# Altium schematic sheet EVB-ANNA-B5_SCHEM_0000_Topsheet.SchDoc
size A3; Date: 7/24/2020; CompanyName: U-Blox; DrawnBy: EMOO; Engineer: EMOO; Organization: U-Blox; Address1: 3950 Fairview Industrial Dr SE #100; Address2: Salem, OR 97302; DocumentNumber: 1; SheetNumber: 1; SheetTotal: 8; SheetSize: B; SheetTitle: TopSheet
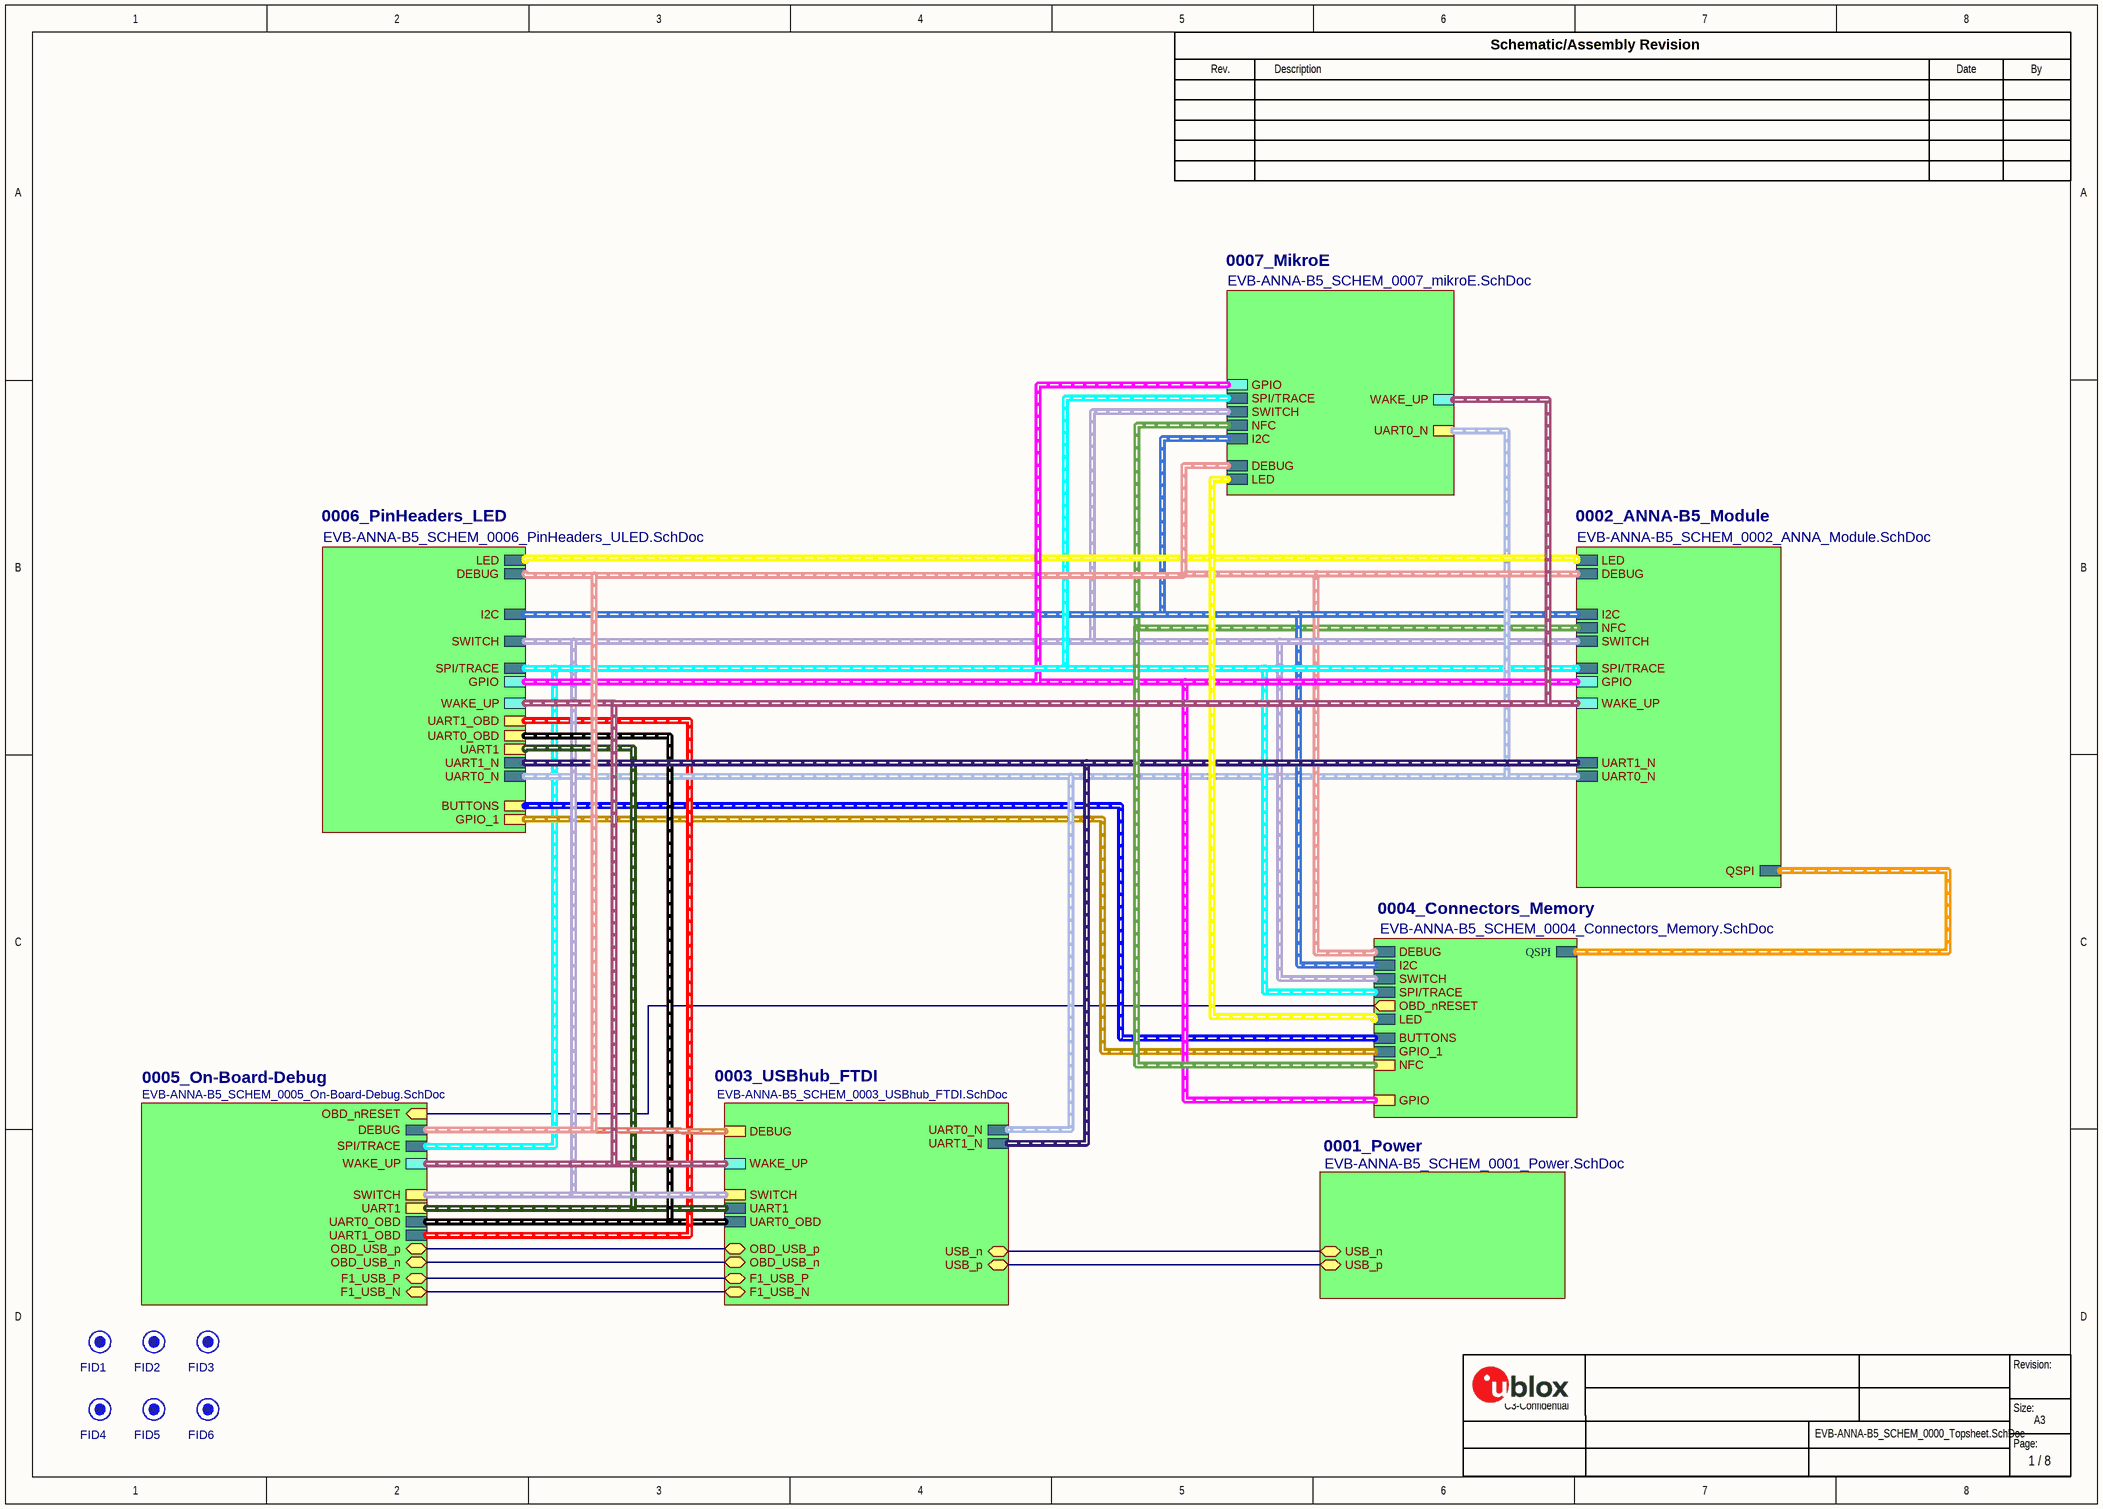
[diagram p0: EVB-ANNA-B5_SCHEM_0000_Topsheet.SchDoc]

## Parts
FID1  FID  [FIDUCIAL40]  (value not drawn)  (no BOM)
FID2  FID  [FIDUCIAL40]  (value not drawn)  (no BOM)
FID3  FID  [FIDUCIAL40]  (value not drawn)  (no BOM)
FID4  FID  [FIDUCIAL40]  (value not drawn)  (no BOM)
FID5  FID  [FIDUCIAL40]  (value not drawn)  (no BOM)
FID6  FID  [FIDUCIAL40]  (value not drawn)  (no BOM)

## Sub-sheets
0001_Power = EVB-ANNA-B5_SCHEM_0001_Power.SchDoc: USB_n (bidir), USB_p (bidir)
0002_ANNA-B5_Module = EVB-ANNA-B5_SCHEM_0002_ANNA_Module.SchDoc: LED (harness LED), DEBUG (harness DEBUG), UART1_N (harness UART1_N), I2C (harness I2C), NFC (harness NFC), SWITCH (harness SWITCH), UART0_N (harness UART0_N), QSPI (harness QSPI), SPI/TRACE (harness SPI/TRACE), GPIO (harness GPIO), WAKE_UP (harness WAKE_UP)
0003_USBhub_FTDI = EVB-ANNA-B5_SCHEM_0003_USBhub_FTDI.SchDoc: USB_n (bidir), USB_p (bidir), F1_USB_P (bidir), F1_USB_N (bidir), UART1 (harness UART1), UART0_N (harness UART0_N), UART1_N (harness UART1_N), UART0_OBD (harness UART0_OBD), DEBUG (harness DEBUG), OBD_USB_n (bidir), OBD_USB_p (bidir), SWITCH (harness SWITCH), WAKE_UP (harness WAKE_UP)
0004_Connectors_Memory = EVB-ANNA-B5_SCHEM_0004_Connectors_Memory.SchDoc: DEBUG (harness DEBUG), I2C (harness I2C), SWITCH (harness SWITCH), QSPI (harness QSPI), SPI/TRACE (harness SPI/TRACE), LED (harness LED), BUTTONS (harness BUTTONS), GPIO_1 (harness GP1O_1), OBD_nRESET (out), NFC (harness NFC), GPIO (harness GPIO)
0005_On-Board-Debug = EVB-ANNA-B5_SCHEM_0005_On-Board-Debug.SchDoc: F1_USB_P (bidir), F1_USB_N (bidir), UART0_OBD (harness UART0_OBD), UART1_OBD (harness UART1_OBD), DEBUG (harness DEBUG), SPI/TRACE (harness SPI/TRACE), OBD_nRESET (in), OBD_USB_p (bidir), OBD_USB_n (bidir), UART1 (harness UART1), SWITCH (harness SWITCH), WAKE_UP (harness WAKE_UP)
0006_PinHeaders_LED = EVB-ANNA-B5_SCHEM_0006_PinHeaders_ULED.SchDoc: I2C (harness I2C), LED (harness LED), SWITCH (harness SWITCH), SPI/TRACE (harness SPI/TRACE), GPIO (harness GPIO), DEBUG (harness DEBUG), UART0_N (harness UART0_N), UART1_N (harness UART1_N), BUTTONS (harness BUTTONS), GPIO_1 (harness GP1O_1), UART1 (harness UART1), UART0_OBD (harness UART0_OBD), UART1_OBD (harness UART1_OBD), WAKE_UP (harness WAKE_UP)
0007_MikroE = EVB-ANNA-B5_SCHEM_0007_mikroE.SchDoc: I2C (harness I2C), LED (harness LED), SWITCH (harness SWITCH), NFC (harness NFC), DEBUG (harness DEBUG), SPI/TRACE (harness SPI/TRACE), GPIO (harness GPIO), UART0_N (harness UART0_N), WAKE_UP (harness WAKE_UP)

## Nets
(unnamed): sheet 0001_Power/USB_n, sheet 0003_USBhub_FTDI/USB_n
(unnamed): sheet 0001_Power/USB_p, sheet 0003_USBhub_FTDI/USB_p
(unnamed): sheet 0003_USBhub_FTDI/F1_USB_P, sheet 0005_On-Board-Debug/F1_USB_P
(unnamed): sheet 0003_USBhub_FTDI/F1_USB_N, sheet 0005_On-Board-Debug/F1_USB_N
(unnamed): sheet 0003_USBhub_FTDI/OBD_USB_n, sheet 0005_On-Board-Debug/OBD_USB_n
(unnamed): sheet 0003_USBhub_FTDI/OBD_USB_p, sheet 0005_On-Board-Debug/OBD_USB_p
(unnamed): sheet 0005_On-Board-Debug/OBD_nRESET, sheet 0004_Connectors_Memory/OBD_nRESET

## Buses and harness runs
harness sheet 0002_ANNA-B5_Module/DEBUG = sheet 0003_USBhub_FTDI/DEBUG = sheet 0004_Connectors_Memory/DEBUG = sheet 0005_On-Board-Debug/DEBUG = sheet 0006_PinHeaders_LED/DEBUG = sheet 0007_MikroE/DEBUG
harness sheet 0002_ANNA-B5_Module/GPIO = sheet 0004_Connectors_Memory/GPIO = sheet 0006_PinHeaders_LED/GPIO = sheet 0007_MikroE/GPIO
harness sheet 0002_ANNA-B5_Module/I2C = sheet 0004_Connectors_Memory/I2C = sheet 0006_PinHeaders_LED/I2C = sheet 0007_MikroE/I2C
harness sheet 0002_ANNA-B5_Module/LED = sheet 0004_Connectors_Memory/LED = sheet 0006_PinHeaders_LED/LED = sheet 0007_MikroE/LED
harness sheet 0002_ANNA-B5_Module/NFC = sheet 0004_Connectors_Memory/NFC = sheet 0007_MikroE/NFC
harness sheet 0002_ANNA-B5_Module/QSPI = sheet 0004_Connectors_Memory/QSPI
harness sheet 0002_ANNA-B5_Module/SPI/TRACE = sheet 0004_Connectors_Memory/SPI/TRACE = sheet 0005_On-Board-Debug/SPI/TRACE = sheet 0006_PinHeaders_LED/SPI/TRACE = sheet 0007_MikroE/SPI/TRACE
harness sheet 0002_ANNA-B5_Module/SWITCH = sheet 0003_USBhub_FTDI/SWITCH = sheet 0004_Connectors_Memory/SWITCH = sheet 0005_On-Board-Debug/SWITCH = sheet 0006_PinHeaders_LED/SWITCH = sheet 0007_MikroE/SWITCH
harness sheet 0002_ANNA-B5_Module/UART0_N = sheet 0003_USBhub_FTDI/UART0_N = sheet 0006_PinHeaders_LED/UART0_N = sheet 0007_MikroE/UART0_N
harness sheet 0002_ANNA-B5_Module/UART1_N = sheet 0003_USBhub_FTDI/UART1_N = sheet 0006_PinHeaders_LED/UART1_N
harness sheet 0002_ANNA-B5_Module/WAKE_UP = sheet 0003_USBhub_FTDI/WAKE_UP = sheet 0005_On-Board-Debug/WAKE_UP = sheet 0006_PinHeaders_LED/WAKE_UP = sheet 0007_MikroE/WAKE_UP
harness sheet 0003_USBhub_FTDI/UART0_OBD = sheet 0005_On-Board-Debug/UART0_OBD = sheet 0006_PinHeaders_LED/UART0_OBD
harness sheet 0003_USBhub_FTDI/UART1 = sheet 0005_On-Board-Debug/UART1 = sheet 0006_PinHeaders_LED/UART1
harness sheet 0004_Connectors_Memory/BUTTONS = sheet 0006_PinHeaders_LED/BUTTONS
harness sheet 0004_Connectors_Memory/GPIO_1 = sheet 0006_PinHeaders_LED/GPIO_1
harness sheet 0005_On-Board-Debug/UART1_OBD = sheet 0006_PinHeaders_LED/UART1_OBD

## Notes on the sheet
- Rev.
- Description
- Schematic/Assembly Revision
- Date
- By
- Revision:
- C3-Confidential
- Page:
- Size:
- A3

## Library data of the parts
FID1-FID6 = FIDUCIAL.04: Fiducial, 0.040" inner Dia, 0.075" outer Dia; Added By: Jeremy D; Part Number: FIDUCIAL.04; Size: 0.040"; Height: 0; DNP: DNP; Added Date: 2/1/2015; Checked By: Paul B; Checked Date: 2/5/2015